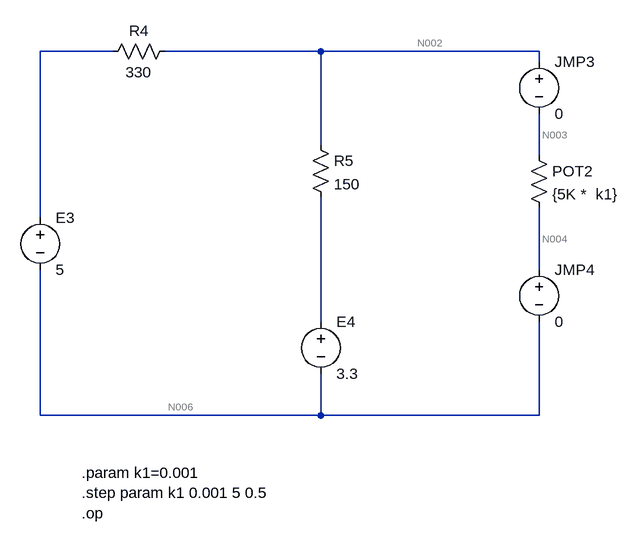
[diagram p0: schematic 51.asc]
51.asc, the LTspice schematic file:
Version 4.1
SHEET 1 928 680
WIRE 128 -112 16 -112
WIRE 448 -112 208 -112
WIRE 784 -112 448 -112
WIRE 784 -96 784 -112
WIRE 448 32 448 -112
WIRE 784 48 784 -16
WIRE 16 144 16 -112
WIRE 784 224 784 128
WIRE 448 304 448 112
WIRE 16 448 16 224
WIRE 448 448 448 384
WIRE 448 448 16 448
WIRE 784 448 784 304
WIRE 784 448 448 448
SYMBOL voltage 16 128 R0
SYMATTR InstName E3
SYMATTR Value 5
SYMBOL voltage 448 288 R0
SYMATTR InstName E4
SYMATTR Value 3.3
SYMBOL res 768 32 R0
SYMATTR InstName POT2
SYMATTR Value {5K *  k1}
SYMBOL res 432 16 R0
SYMATTR InstName R5
SYMATTR Value 150
SYMBOL res 224 -128 R90
WINDOW 0 0 56 VBottom 2
WINDOW 3 32 56 VTop 2
SYMATTR InstName R4
SYMATTR Value 330
SYMBOL voltage 784 -112 R0
SYMATTR InstName JMP3
SYMATTR Value 0
SYMBOL voltage 784 208 R0
SYMATTR InstName JMP4
SYMATTR Value 0
TEXT 80 536 Left 2 !.param k1=0.001\n.step param k1 0.001 5 0.5\n.op

The netlist it stands for:
* 51.asc
V§E3 N001 N006 5
V§E4 N005 N006 3.3
R§POT2 N003 N004 {5K *  k1}
R5 N002 N005 150
R4 N002 N001 330
V§JMP3 N002 N003 0
V§JMP4 N004 N006 0
.param k1=0.001
.step param k1 0.001 5 0.5
.op
.backanno
.end

* Results of the author's LTspice run, read from the files saved beside the schematic
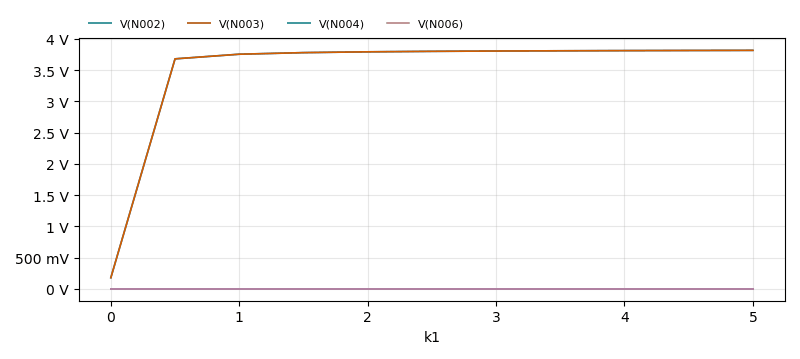
[diagram p1: Operating Point of 51.asc, plotted from the saved traces]
* Operating Point, 1 run:
*   V(N002): 177.2 mV at k1=1 m, 3.816 V at k1=5 , min 177.2 mV, max 3.816 V
*   V(N003): 177.2 mV at k1=1 m, 3.816 V at k1=5 , min 177.2 mV, max 3.816 V
*   V(N004): 0 V at k1=1 m, 0 V at k1=5 , min -6.019e-09 fV, max 0 V
*   V(N006): 0 V at k1=1 m, 0 V at k1=5 , min -6.019e-09 fV, max 0 V